# Altium schematic sheet Servomoteur.SchDoc
size A4; Author: Audran; CompanyName: Goldorak; Address1: Electrolab; Address2: 52 rue Paul Lescop; Address3: 92000 Nanterre; DocumentNumber: 6; SheetNumber: 6; SheetTotal: 8; ProjectName: Cartes_2017
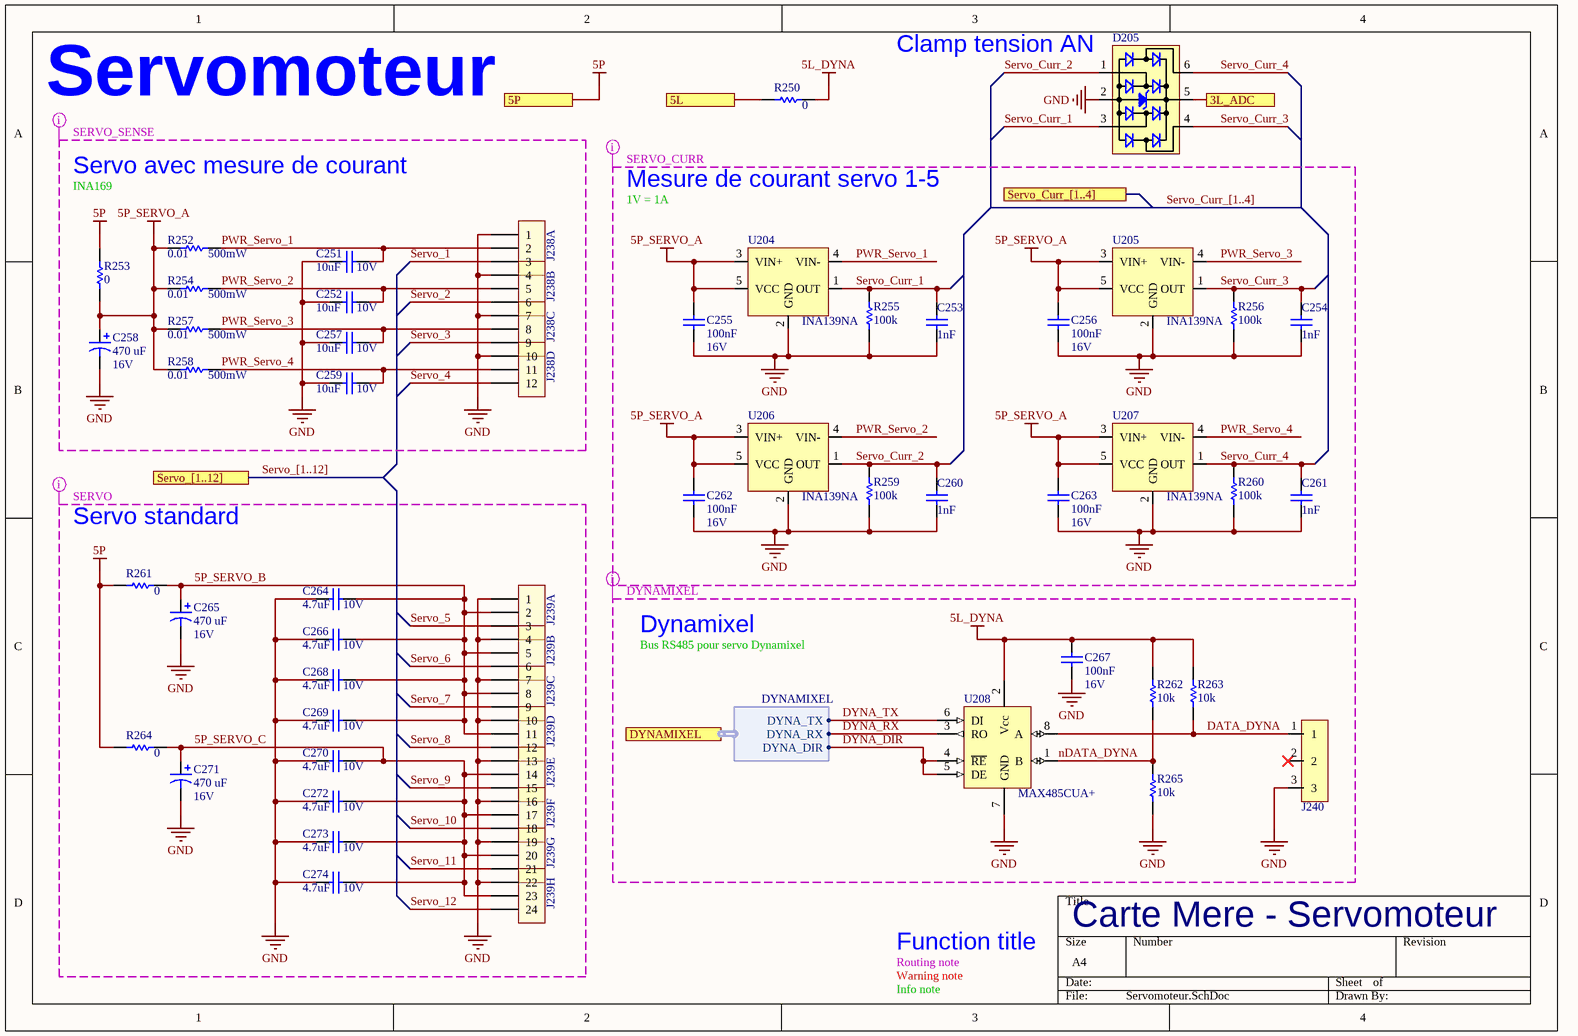
[diagram p0: Servomoteur.SchDoc]

## Parts
C251  10uF  RatedVoltage: 10V  [WCAP-CSGP_0805, 2x1.25x1.25]
C252  10uF  RatedVoltage: 10V  [WCAP-CSGP_0805, 2x1.25x1.25]
C253  1nF  [WCAP-CSGP_0402, 1x0.5x0.5]
C254  1nF  [WCAP-CSGP_0402, 1x0.5x0.5]
C255  100nF  RatedVoltage: 16V  [WCAP-CSGP_0402, 1x0.5x0.5]
C256  100nF  RatedVoltage: 16V  [WCAP-CSGP_0402, 1x0.5x0.5]
C257  10uF  RatedVoltage: 10V  [WCAP-CSGP_0805, 2x1.25x1.25]
C258  470 uF  RatedVoltage: 16V  [WCAP-ATG8_8x11.5x3.5x0.5]
C259  10uF  RatedVoltage: 10V  [WCAP-CSGP_0805, 2x1.25x1.25]
C260  1nF  [WCAP-CSGP_0402, 1x0.5x0.5]
C261  1nF  [WCAP-CSGP_0402, 1x0.5x0.5]
C262  100nF  RatedVoltage: 16V  [WCAP-CSGP_0402, 1x0.5x0.5]
C263  100nF  RatedVoltage: 16V  [WCAP-CSGP_0402, 1x0.5x0.5]
C264  4.7uF  RatedVoltage: 10V  [WCAP-CSGP_0603, 1.6x0.8x0.8]
C265  470 uF  RatedVoltage: 16V  [WCAP-ATG8_8x11.5x3.5x0.5]
C266  4.7uF  RatedVoltage: 10V  [WCAP-CSGP_0603, 1.6x0.8x0.8]
C267  100nF  RatedVoltage: 16V  [WCAP-CSGP_0402, 1x0.5x0.5]
C268  4.7uF  RatedVoltage: 10V  [WCAP-CSGP_0603, 1.6x0.8x0.8]
C269  4.7uF  RatedVoltage: 10V  [WCAP-CSGP_0603, 1.6x0.8x0.8]
C270  4.7uF  RatedVoltage: 10V  [WCAP-CSGP_0603, 1.6x0.8x0.8]
C271  470 uF  RatedVoltage: 16V  [WCAP-ATG8_8x11.5x3.5x0.5]
C272  4.7uF  RatedVoltage: 10V  [WCAP-CSGP_0603, 1.6x0.8x0.8]
C273  4.7uF  RatedVoltage: 10V  [WCAP-CSGP_0603, 1.6x0.8x0.8]
C274  4.7uF  RatedVoltage: 10V  [WCAP-CSGP_0603, 1.6x0.8x0.8]
D205  824001  [SOT-23-6L]  (value not drawn)
J238  TSW-104-08-F-T-RA  [TSW-104-08-F-T-RA]  (value not drawn)  (parts A,B,C,D of 4)
J239  TSW-104-08-F-T-RA  [TSW-108-08-F-T-RA]  (value not drawn)  (parts A,B,C,D,E,F,G,H of 8)
J240  22-03-5035  [20-03-5035]  (value not drawn)
R250  value 0  [RESC1608X06N]  (hidden comment: RC0603FR-070RL)
R252  value 0.01  Power: 500mW  [RESC2012X06N]  (hidden comment: CRF0805-FZ-R010ELF)
R253  value 0  [RESC1608X06N]  (hidden comment: RC0603FR-070RL)
R254  value 0.01  Power: 500mW  [RESC2012X06N]  (hidden comment: CRF0805-FZ-R010ELF)
R255  value 100k  [RESC1005X04N]  (hidden comment: RC0402FR-07100KL)
R256  value 100k  [RESC1005X04N]  (hidden comment: RC0402FR-07100KL)
R257  value 0.01  Power: 500mW  [RESC2012X06N]  (hidden comment: CRF0805-FZ-R010ELF)
R258  value 0.01  Power: 500mW  [RESC2012X06N]  (hidden comment: CRF0805-FZ-R010ELF)
R259  value 100k  [RESC1005X04N]  (hidden comment: RC0402FR-07100KL)
R260  value 100k  [RESC1005X04N]  (hidden comment: RC0402FR-07100KL)
R261  value 0  [RESC1608X06N]  (hidden comment: RC0603FR-070RL)
R262  value 10k  [RESC1005X04N]  (hidden comment: RC0402FR-0710KL)
R263  value 10k  [RESC1005X04N]  (hidden comment: RC0402FR-0710KL)
R264  value 0  [RESC1608X06N]  (hidden comment: RC0603FR-070RL)
R265  value 10k  [RESC1005X04N]  (hidden comment: RC0402FR-0710KL)
U204  INA139NA  [SOT23_95P280X145-5N]
U205  INA139NA  [SOT23_95P280X145-5N]
U206  INA139NA  [SOT23_95P280X145-5N]
U207  INA139NA  [SOT23_95P280X145-5N]
U208  MAX485CUA+  [MSOP-8]

## Ports
3L_ADC, 5L, 5P, DYNAMIXEL (harness DYNAMIXEL), Servo_[1..12], Servo_Curr_[1..4]

## Harnesses
DYNAMIXEL: DYNA_TX, DYNA_RX, DYNA_DIR

## Nets
5L_DYNA: C267.1 R250.2 R262.2 R263.2 U208.2(Vcc)
5P: R253.1 R261.1 R264.1 ; port 5P
5P_SERVO_A: C255.1 C256.1 C258.1 C262.1 C263.1 R252.1 R253.2 R254.1 R257.1 R258.1 U204.3(VIN+) U204.5(VCC) U205.3(VIN+) U205.5(VCC) U206.3(VIN+) U206.5(VCC) U207.3(VIN+) U207.5(VCC)
GND: C251.1 C252.1 C253.2 C254.2 C255.2 C256.2 C257.1 C258.2 C259.1 C260.2 C261.2 C262.2 C263.2 C264.2 C265.2 C266.2 C267.2 C268.2 C269.2 C270.2 C271.2 C272.2 C273.2 C274.2 D205.2 J238.1 J238.4 J238.7 J238.10 J239.1 J239.4 J239.7 J239.10 J239.13 J239.16 J239.19 J239.22 J240.3 R255.2 R256.2 R259.2 R260.2 R265.1 U204.2(GND) U205.2(GND) U206.2(GND) U207.2(GND) U208.7(GND)
3L_ADC: D205.5 ; port 3L_ADC
5L: R250.1 ; port 5L
5P_SERVO_B: C264.1 C265.1 C266.1 C268.1 C269.1 J239.2 J239.5 J239.8 J239.11 R261.2
5P_SERVO_C: C270.1 C271.1 C272.1 C273.1 C274.1 J239.14 J239.17 J239.20 J239.23 R264.2
DATA_DYNA: J240.1 R263.1 U208.8(A)
DYNA_DIR: U208.4(~{RE}) U208.5(DE) ; port DYNAMIXEL.DYNA_DIR
DYNA_RX: U208.3(RO) ; port DYNAMIXEL.DYNA_RX
DYNA_TX: U208.6(DI) ; port DYNAMIXEL.DYNA_TX
nDATA_DYNA: R262.1 R265.2 U208.1(B)
PWR_Servo_1: C251.2 J238.2 R252.2 U204.4(VIN-)
PWR_Servo_2: C252.2 J238.5 R254.2 U206.4(VIN-)
PWR_Servo_3: C257.2 J238.8 R257.2 U205.4(VIN-)
PWR_Servo_4: C259.2 J238.11 R258.2 U207.4(VIN-)
Servo_1: J238.3
Servo_2: J238.6
Servo_3: J238.9
Servo_4: J238.12
Servo_5: J239.3
Servo_6: J239.6
Servo_7: J239.9
Servo_8: J239.12
Servo_9: J239.15
Servo_10: J239.18
Servo_11: J239.21
Servo_12: J239.24
Servo_Curr_1: C253.1 D205.3 R255.1 U204.1(OUT)
Servo_Curr_2: C260.1 D205.1 R259.1 U206.1(OUT)
Servo_Curr_3: C254.1 D205.4 R256.1 U205.1(OUT)
Servo_Curr_4: C261.1 D205.6 R260.1 U207.1(OUT)

Not connected (* = marked no-connect by the designer): J240 2*

## Buses and harness runs
bus Servo_[1..12] = port Servo_[1..12]
bus Servo_Curr_[1..4] = port Servo_Curr_[1..4]

## Layout directives
net class DYNAMIXEL: 5L_DYNA, DATA_DYNA, DYNA_DIR, DYNA_RX, DYNA_TX, GND, nDATA_DYNA
net class SERVO_CURR: 5P_SERVO_A, GND, PWR_Servo_1, PWR_Servo_2, PWR_Servo_3, PWR_Servo_4, Servo_Curr_1, Servo_Curr_2, Servo_Curr_3, Servo_Curr_4, Servo_Curr_[1..4]
net class SERVO_SENSE: 5P, 5P_SERVO_A, GND, PWR_Servo_1, PWR_Servo_2, PWR_Servo_3, PWR_Servo_4, Servo_1, Servo_2, Servo_3, Servo_4
net class SERVO: 5P, 5P_SERVO_B, 5P_SERVO_C, GND, Servo_5, Servo_6, Servo_7, Servo_8, Servo_9, Servo_10, Servo_11, Servo_12

## Notes on the sheet
- Servomoteur
- (near D205) Clamp tension AN
- Servo avec mesure de courant
- INA169
- 1V = 1A
- Mesure de courant servo 1-5
- Servo standard
- Dynamixel
- Bus RS485 pour servo Dynamixel
- Routing note
- Warning note
- Function title
- Carte Mere - Servomoteur
- Info note

## Library data of the parts
C251 C252 C257 C259 = WCAP-CSGP, 885012207026: CAP CER 10uF 10V X7R 0805; Manufacturer: Wurth Elektronik; ComponentLink1Description: Datasheet; ComponentLink1URL: http://katalog.we-online.com/pbs/datasheet/885012207026.pdf; Manufacturer Part Number: 885012207026; Value: 10uF; Size: 0805; CeramicType: X7R; Supplier 1: Farnell; Supplier Part Number 1: 2495189; Supplier Part Number 2: C15850; Supplier 2: JLCPCB; Supplier Footprint 2: 0805
C253 C254 C260 C261 = WCAP-CSGP, 885012205061: CAP CER 1nF 50V X7R 0402; Manufacturer: Wurth Elektronik; ComponentLink1Description: Datasheet; ComponentLink1URL: http://katalog.we-online.com/pbs/datasheet/885012205061.pdf; Manufacturer Part Number: 885012205061; Value: 1nF; Size: 0402; CeramicType: X7R; RatedVoltage: 50V; Supplier 2: JLCPCB; Supplier Part Number 2: C1523; Supplier Footprint 2: 0402
C255 C256 C262 C263 C267 = WCAP-CSGP, 885012205037: CAP CER 100nF 16V X7R 0402; Manufacturer: Wurth Elektronik; ComponentLink1Description: Datasheet; ComponentLink1URL: http://katalog.we-online.com/pbs/datasheet/885012205037.pdf; Manufacturer Part Number: 885012205037; Value: 100nF; Size: 0402; CeramicType: X7R; Supplier 2: JLCPCB; Supplier Part Number 2: C1525; Supplier Footprint 2: 0402
C258 C265 C271 = WCAP-ATG8, 860010374012: CAP Alu 470 UF 20% 16 V; Manufacturer: Wurth Elektronik; ComponentLink1Description: Datasheet; ComponentLink1URL: http://katalog.we-online.de/pbs/datasheet/860010374012.pdf; Manufacturer Part Number: 860010374012; Value: 470 uF; Size: 8mmx11.5mm
C264 C266 C268-C270 C272-C274 = WCAP-CSGP, 885012106012: CAP CER 4.7UF 10V X5R 0603; Manufacturer: Wurth Elektronik; ComponentLink1Description: Datasheet; ComponentLink1URL: http://katalog.we-online.com/pbs/datasheet/885012106012.pdf; Manufacturer Part Number: 885012106012; Value: 4.7uF; Size: 0603; CeramicType: X5R; Supplier 2: JLCPCB; Supplier Part Number 2: C19666; Supplier Footprint 2: 0603
D205 = 824001: WE-TVS TVS Diode 4+1Ch 5V SOT23-6L; Manufacturer: Wurth Elektronik; ComponentLink1Description: Datasheet; ComponentLink1URL: https://www.we-online.com/catalog/datasheet/824001.pdf; Manufacturer Part Number: 824001; Supplier 1: Farnell; Supplier Part Number 1: 1748613; Type: TVS; Value: 5V; Supplier 2: JLCPCB; Supplier Part Number 2: C85364; Supplier Footprint 2: SOT-23-6L
J238 = TSW-104-08-F-T-RA: CONN HEADER R/A 3L x 4POS 2.54MM; Manufacturer: SAMTEC; Manufacturer Part Number: TSW-104-08-F-T-RA; Supplier 1: Farnell; Supplier Part Number 1: 2053041; ComponentLink1Description: Datasheet; ComponentLink1URL: http://cloud.samtec.com/catalog_english/TSW_TH.PDF
J239 = TSW-108-08-F-T-RA: CONN HEADER R/A 3L x 8POS 2.54MM; Manufacturer: SAMTEC; Manufacturer Part Number: TSW-104-08-F-T-RA; Supplier 1: Farnell; ComponentLink1Description: Datasheet; ComponentLink1URL: http://cloud.samtec.com/catalog_english/TSW_TH.PDF; Supplier Part Number 1: 2053046
J240 = 20-03-5035: CONN HEADER VERT 3POS 2.5MM; Manufacturer: MOLEX; Supplier 1: Farnell; Supplier Part Number 1: 9979620; Manufacturer Part Number: 22-03-5035; ComponentLink1URL: http://www.farnell.com/datasheets/1801024.pdf; ComponentLink1Description: Datasheet; ComponentLink2URL: http://www.farnell.com/cad/495071.pdf  http://www.farnell.com/cad/1533907.pdf  http://www.farnell.com/cad/1533907.pdf; ComponentLink2Description: Drawings
R250 R253 R261 R264 = RC0603FR-070RL: RES SMD 0 OHM 1% 1/10W 0603; Manufacturer: Yageo; Power: 100mW; Vmax: 50V; Manufacturer Part Number: RC0603FR-070RL; Type: Thick Film; ComponentLink1Description: Manufacturer; ComponentLink1URL: http://www.yageo.com/NewPortal/_en/index.jsp; ComponentLink2Description: Datasheet; ComponentLink2URL: http://www.farnell.com/datasheets/2167052.pdf; Supplier 1: Farnell; Precision: ±1%; Supplier Part Number 1: 2309106; Supplier 2: JLCPCB; Supplier Part Number 2: C21189; Supplier Footprint 2: 0603
R252 R254 R257 R258 = CRF0805-FZ-R010ELF: RES 0.01 OHM 1% 500mW 0805; Manufacturer: Bourns; Vmax: 200V; Type: Thick film; Manufacturer Part Number: CRF0805-FZ-R010ELF; Precision: ±1%; ComponentLink1URL: https://www.bourns.com/docs/Product-Datasheets/CRF.pdf; ComponentLink1Description: Manufacturer; ComponentLink2URL: http://www.farnell.com/datasheets/1970564.pdf; ComponentLink2Description: Datasheet; Supplier 1: Farnell; Supplier Part Number 1: 2372977
R255 R256 R259 R260 = RC0402FR-07100KL: RES SMD 100K OHM 1% 1/16W 0402; Manufacturer: Yageo; Power: 63mW; Vmax: 50V; Type: Thick Film; ComponentLink1Description: Manufacturer; ComponentLink1URL: http://www.yageo.com/NewPortal/_en/index.jsp; ComponentLink2Description: Datasheet; ComponentLink2URL: http://www.farnell.com/datasheets/2167052.pdf; Manufacturer Part Number: RC0402FR-07100KL; Supplier 1: Farnell; Supplier Part Number 1: 9239472; Precision: ±1%; Supplier 2: JLCPCB; Supplier Part Number 2: C25741; Supplier Footprint 2: 0402
R262 R263 R265 = RC0402FR-0710KL: RES SMD 10K OHM 1% 1/16W 0402; Manufacturer: Yageo; Power: 63mW; Vmax: 50V; Type: Thick Film; ComponentLink1Description: Manufacturer; ComponentLink1URL: http://www.yageo.com/NewPortal/_en/index.jsp; ComponentLink2Description: Datasheet; ComponentLink2URL: http://www.farnell.com/datasheets/2167052.pdf; Supplier 1: Farnell; Supplier Part Number 1: 9239359; Manufacturer Part Number: RC0402FR-0710KL; Precision: ±1%; Supplier 2: JLCPCB; Supplier Part Number 2: C25744; Supplier Footprint 2: 0402
U204-U207 = INA139NA: IC CURRENT MONITOR 0.5% SOT23-5; Manufacturer: Texas Instruments; Manufacturer Part Number: INA139NA; ComponentLink1URL: http://www.ti.com/lit/ds/symlink/ina139.pdf; ComponentLink1Description: Datasheet; Supplier 1: Farnell; Supplier Part Number 1: 3118123
U208 = MAX485CUA+: IC TXRX RS485/RS422 8-UMAX; Manufacturer: Maxim Integrated; Manufacturer Part Number: MAX485CUA+; ComponentLink1URL: http://datasheets.maximintegrated.com/en/ds/MAX1487-MAX491.pdf; ComponentLink1Description: Datasheet; Supplier 1: Farnell; Supplier Part Number 1: 2511735